# Altium schematic sheet Main MCU. Page 1.SchDoc
size 420 x 297 mm; Address1: Address1; Address2: Address2; Address3: Address3; Address4: Address4; DocumentNumber: АБВГ.123456.001 Э3; SheetNumber: 1; SheetTotal: 7; Scale: 1:1; DocumentType: Схема электрическая принципиальная; FirstReferrence: АБВГ.123456.001
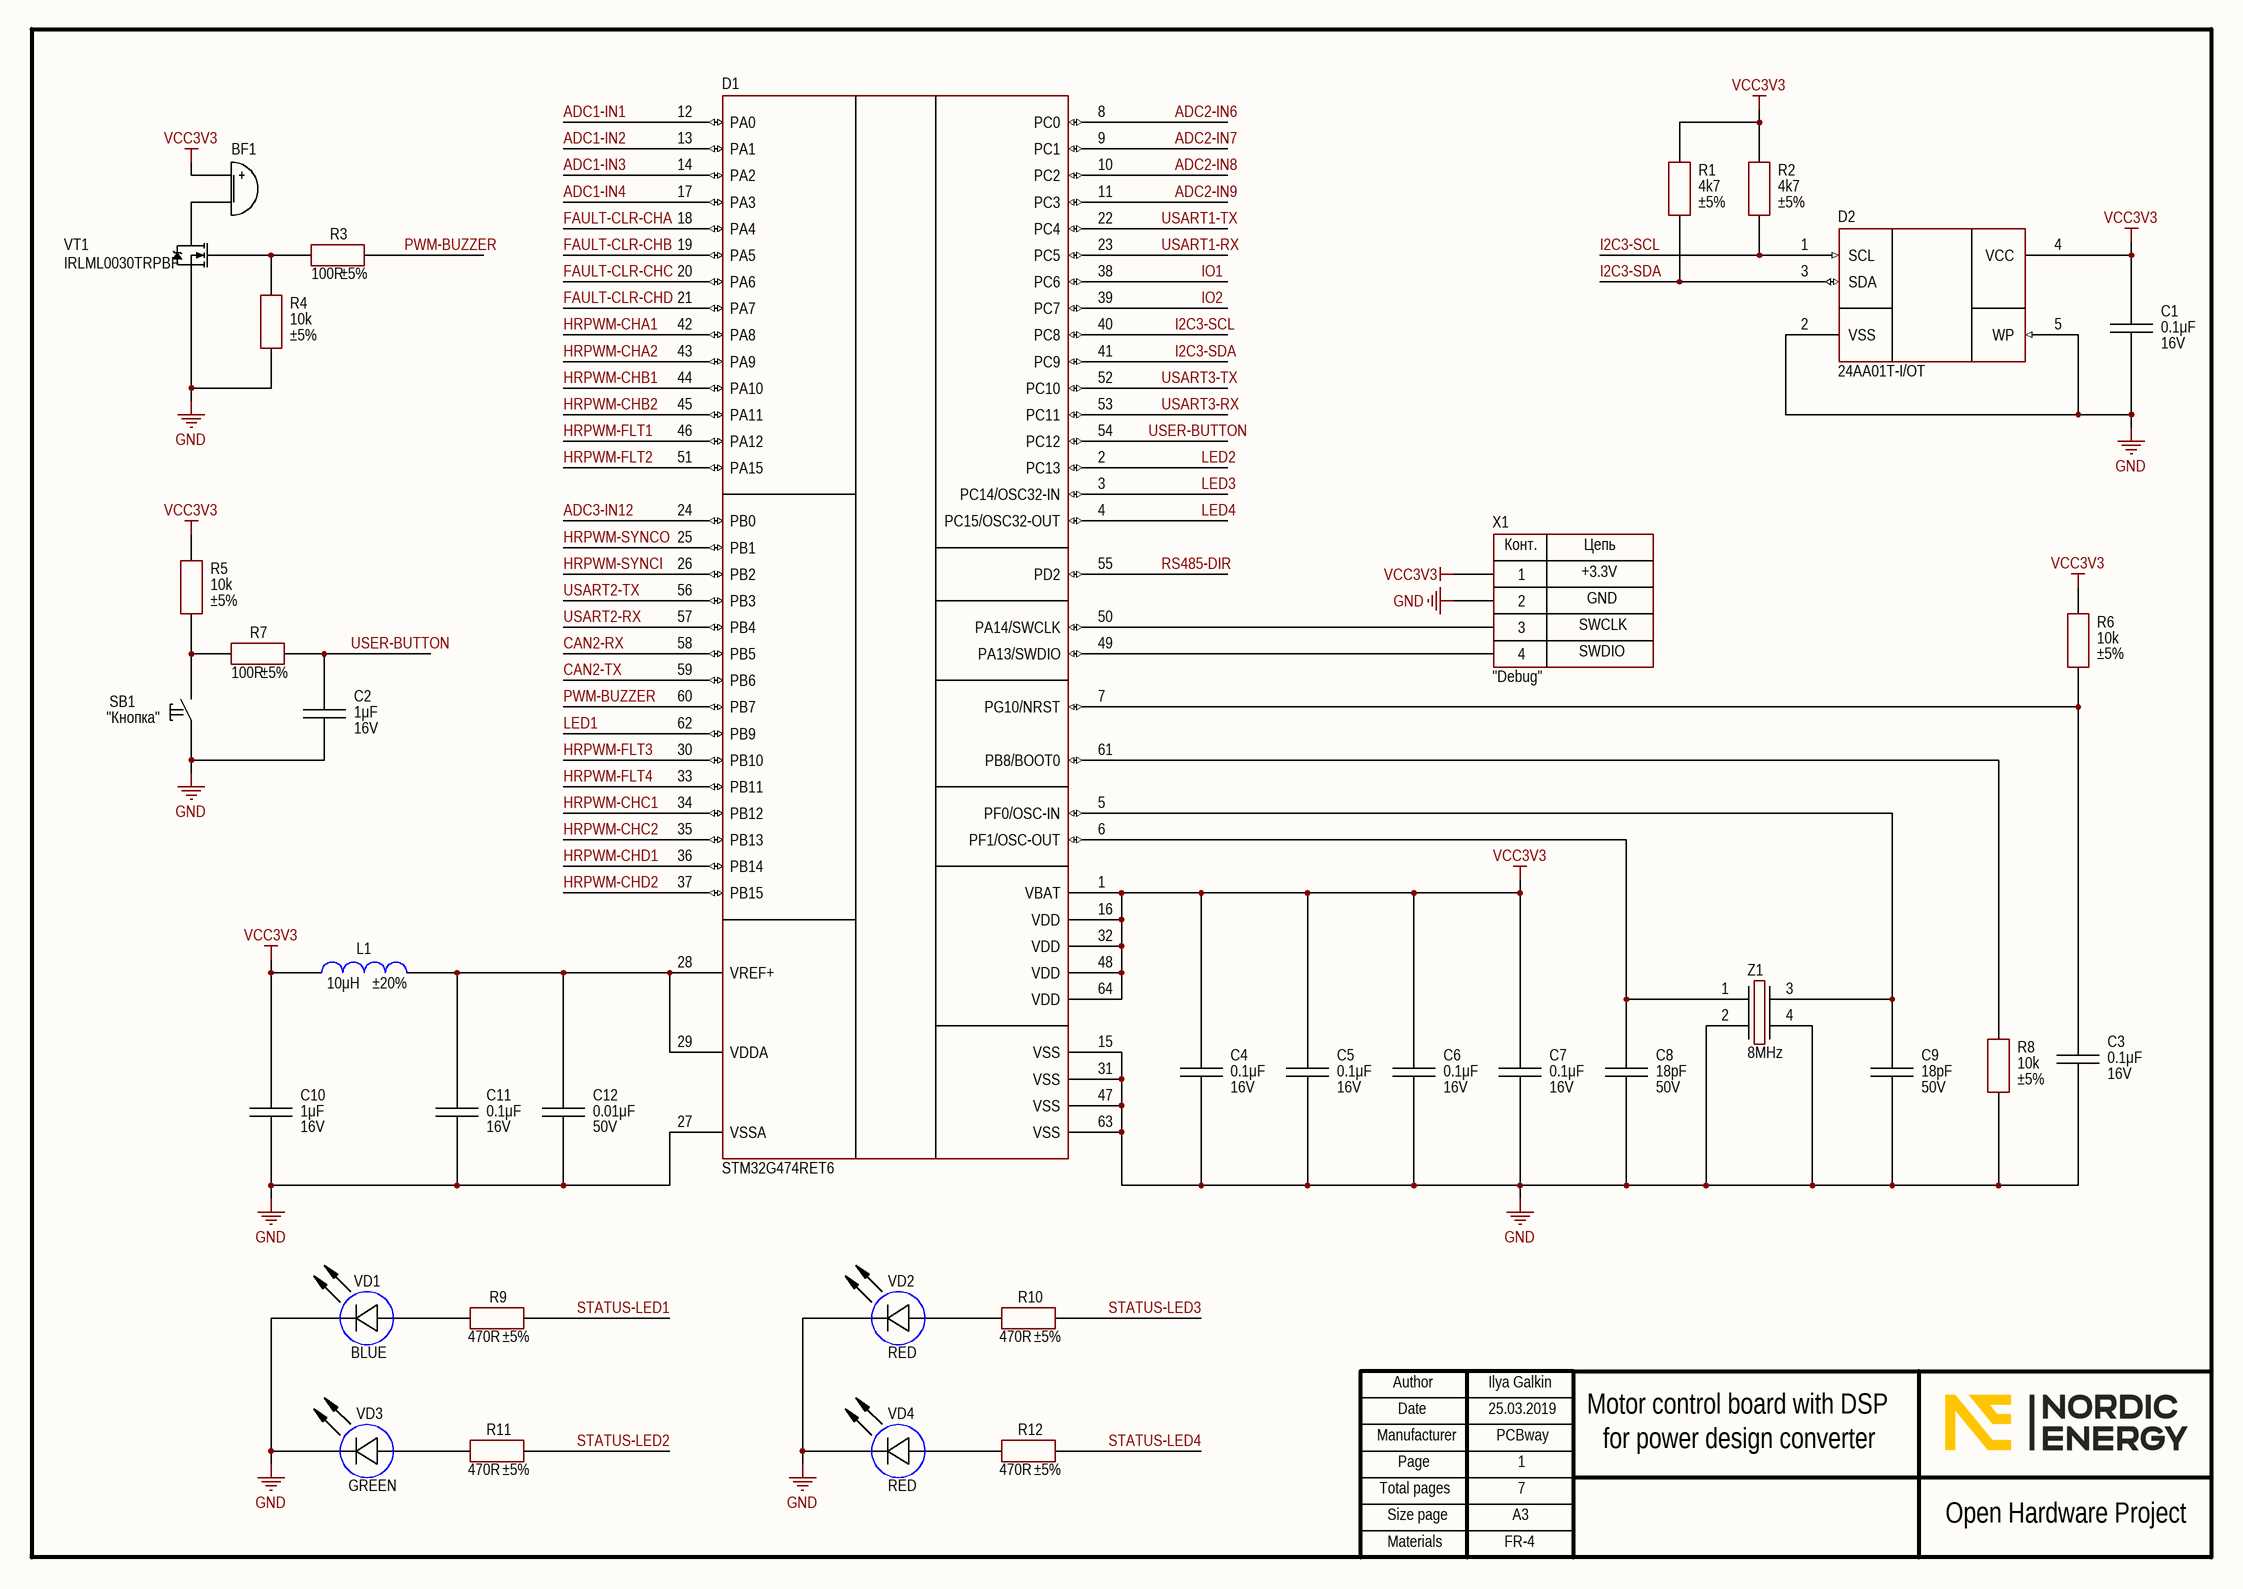
[diagram p0: Main MCU. Page 1.SchDoc]

## Parts
BF1  (no value)  [BUZ: AT-0927-TT-6-R]
C1  value 0.1μF  Voltage: 16V  [CAP: 0805]
C2  value 1μF  Voltage: 16V  [CAP: 0805]
C3  value 0.1μF  Voltage: 16V  [CAP: 0805]
C4  value 0.1μF  Voltage: 16V  [CAP: 0805]
C5  value 0.1μF  Voltage: 16V  [CAP: 0805]
C6  value 0.1μF  Voltage: 16V  [CAP: 0805]
C7  value 0.1μF  Voltage: 16V  [CAP: 0805]
C8  value 18pF  Voltage: 50V  [CAP: 0805]
C9  value 18pF  Voltage: 50V  [CAP: 0805]
C10  value 1μF  Voltage: 16V  [CAP: 0805]
C11  value 0.1μF  Voltage: 16V  [CAP: 0805]
C12  value 0.01μF  Voltage: 50V  [CAP: 0805]
D1  (no value)  [64-LQFP]
D2  PartNumber: 24AA01T-I/OT  [SOT23-5]
L1  value 10μH  Tolerance: ±20%  [IND: 0805]
R1  value 4k7  Tolerance: ±5%  [RES: 0805]
R2  value 4k7  Tolerance: ±5%  [RES: 0805]
R3  value 100R  Tolerance: ±5%  [RES: 0805]
R4  value 10k  Tolerance: ±5%  [RES: 0805]
R5  value 10k  Tolerance: ±5%  [RES: 0805]
R6  value 10k  Tolerance: ±5%  [RES: 0805]
R7  value 100R  Tolerance: ±5%  [RES: 0805]
R8  value 10k  Tolerance: ±5%  [RES: 0805]
R9  value 470R  Tolerance: ±5%  [RES: 0805]
R10  value 470R  Tolerance: ±5%  [RES: 0805]
R11  value 470R  Tolerance: ±5%  [RES: 0805]
R12  value 470R  Tolerance: ±5%  [RES: 0805]
SB1  CommentText: "Кнопка"  [BUT: 6x6 SMD]
VD1  Color: BLUE  [LED: 0805B]
VD2  Color: RED  [LED: 0805R]
VD3  Color: GREEN  [LED: 0603G]
VD4  Color: RED  [LED: 0805R]
VT1  PartNumber: IRLML0030TRPBF  [SOT23]
X1  CommentText: "Debug"  [CON: SM04B-GHS]
Z1  Frequency: 8MHz  [OSC: 5032]

## Nets
GND: C1.1 C2.1 C3.1 C4.1 C5.1 C6.1 C7.1 C8.1 C9.1 C10.1 C11.1 C12.1 D1.15(VSS) D1.27(VSSA) D1.31(VSS) D1.47(VSS) D1.63(VSS) D2.2(VSS) D2.5(WP) R4.2 R8.2 SB1.1 VD1.2(C) VD2.2(C) VD3.2(C) VD4.2(C) VT1.2(S) X1.2 Z1.2 Z1.4
VCC3V3: BF1.1(+) C1.2 C4.2 C5.2 C6.2 C7.2 C10.2 D1.1(VBAT) D1.16(VDD) D1.32(VDD) D1.48(VDD) D1.64(VDD) D2.4(VCC) L1.2 R1.1 R2.1 R5.1 R6.1 X1.1
ADC1-IN1: D1.12(PA0)
ADC1-IN2: D1.13(PA1)
ADC1-IN3: D1.14(PA2)
ADC1-IN4: D1.17(PA3)
ADC2-IN6: D1.8(PC0)
ADC2-IN7: D1.9(PC1)
ADC2-IN8: D1.10(PC2)
ADC2-IN9: D1.11(PC3)
ADC3-IN12: D1.24(PB0)
CAN2-RX: D1.58(PB5)
CAN2-TX: D1.59(PB6)
FAULT-CLR-CHA: D1.18(PA4)
FAULT-CLR-CHB: D1.19(PA5)
FAULT-CLR-CHC: D1.20(PA6)
FAULT-CLR-CHD: D1.21(PA7)
HRPWM-CHA1: D1.42(PA8)
HRPWM-CHA2: D1.43(PA9)
HRPWM-CHB1: D1.44(PA10)
HRPWM-CHB2: D1.45(PA11)
HRPWM-CHC1: D1.34(PB12)
HRPWM-CHC2: D1.35(PB13)
HRPWM-CHD1: D1.36(PB14)
HRPWM-CHD2: D1.37(PB15)
HRPWM-FLT1: D1.46(PA12)
HRPWM-FLT2: D1.51(PA15)
HRPWM-FLT3: D1.30(PB10)
HRPWM-FLT4: D1.33(PB11)
HRPWM-SYNCI: D1.26(PB2)
HRPWM-SYNCO: D1.25(PB1)
I2C3-SCL: D1.40(PC8) D2.1(SCL) R2.2
I2C3-SDA: D1.41(PC9) D2.3(SDA) R1.2
IO1: D1.38(PC6)
IO2: D1.39(PC7)
LED1: D1.62(PB9)
LED2: D1.2(PC13)
LED3: D1.3(PC14/OSC32-IN)
LED4: D1.4(PC15/OSC32-OUT)
PWM-BUZZER: D1.60(PB7) R3.2
RS485-DIR: D1.55(PD2)
STATUS-LED1: R9.2
STATUS-LED2: R11.2
STATUS-LED3: R10.2
STATUS-LED4: R12.2
USART1-RX: D1.23(PC5)
USART1-TX: D1.22(PC4)
USART2-RX: D1.57(PB4)
USART2-TX: D1.56(PB3)
USART3-RX: D1.53(PC11)
USART3-TX: D1.52(PC10)
USER-BUTTON: C2.2 D1.54(PC12) R7.2
NetBF1_2: BF1.2(-) VT1.3(D)
NetC3_2: C3.2 D1.7(PG10/NRST) R6.2
NetC8_2: C8.2 D1.6(PF1/OSC-OUT) Z1.1
NetC9_2: C9.2 D1.5(PF0/OSC-IN) Z1.3
NetC11_2: C11.2 C12.2 D1.28(VREF+) D1.29(VDDA) L1.1
NetD1_49: D1.49(PA13/SWDIO) X1.4
NetD1_50: D1.50(PA14/SWCLK) X1.3
NetD1_61: D1.61(PB8/BOOT0) R8.1
NetR3_1: R3.1 R4.1 VT1.1(G)
NetR5_2: R5.2 R7.1 SB1.2
NetR9_1: R9.1 VD1.1(A)
NetR10_1: R10.1 VD2.1(A)
NetR11_1: R11.1 VD3.1(A)
NetR12_1: R12.1 VD4.1(A)

## Notes on the sheet
- +3.3V
- SWDIO
- SWCLK
- GND
- Ilya Galkin
- 25.03.2019
- PCBway
- 1
- Motor control board with DSP
- for power design converter
- 7
- FR-4
- Author
- Manufacturer
- Date
- Page
- Total pages
- Size page
- A3
- Open Hardware Project
- Materials
- (in symbol Connector_SM04B) Конт.; Цепь

## Library data of the parts
BF1 = Buzzer: Manufacturer: PUI Audio; ValueManufacturerPartNumber: DIP switch, 2.73 kHz, 3VDC, 80mA, -20...+70°C; PartNumber: AT-0927-TT-6-R; TypeBuzzer: DIP switch; VoltageMax: 3VDC; Frequency: 2.73 kHz; CurrentMax: 80mA; HelpURL: https://www.digikey.com/products/en?keywords=AT-0927-TT-6-R; Temperature: -20...+70°C
C1 C3-C7 C11 = Ceramic_0805: Manufacturer: Yageo; PartNumber: CC0805KRX7R7BB104; ValueManufacturerPartNumber: Ceramic capacitor, 0.1μF, X7R, ±10%, 16V, 0805, -55...+125°C; TypeCapacitor: Ceramic capacitor; Tolerance: ±10%; TypeDielectric: X7R; Package: 0805; HelpURL: https://www.digikey.com/product-detail/en/yageo/CC0805KRX7R7BB104/311-1142-1-ND/303052; Temperature: -55...+125°C
C2 C10 = Ceramic_0805: Manufacturer: Yageo; PartNumber: CC0805KKX7R7BB105; ValueManufacturerPartNumber: Ceramic capacitor, 1μF, X7R, ±10%, 16V, 0805, -55...+125°C; TypeCapacitor: Ceramic capacitor; Tolerance: ±10%; TypeDielectric: X7R; Package: 0805; HelpURL: https://www.digikey.com/product-detail/en/yageo/CC0805KKX7R7BB105/311-1365-1-ND/2103149; Temperature: -55...+125°C
C8 C9 = Ceramic_0805: Manufacturer: Yageo; PartNumber: CC0805JRNPO9BN180; ValueManufacturerPartNumber: Ceramic capacitor, 18pF, NPO, ±10%, 50V, 0805, -55...+125°C; TypeCapacitor: Ceramic capacitor; Tolerance: ±10%; TypeDielectric: NPO; Package: 0805; HelpURL: https://www.digikey.com/product-detail/en/yageo/CC0805JRNPO9BN180/311-1102-1-ND/303012; Temperature: -55...+125°C
C12 = Ceramic_0805: Manufacturer: Yageo; PartNumber: CC0805KRX7R9BB103; ValueManufacturerPartNumber: Ceramic capacitor, 0.01μF, X7R, ±10%, 50V, 0805, -55...+125°C; TypeCapacitor: Ceramic capacitor; Tolerance: ±10%; TypeDielectric: X7R; Package: 0805; HelpURL: https://www.digikey.com/product-detail/en/yageo/CC0805KRX7R9BB103/311-1136-1-ND/303046; Temperature: -55...+125°C
D1 = STM32G474RET6: Cortex-M4; Manufacturer: STMicroelectronics; ValueManufacturerPartNumber: IC microcontroller, 32-Bit, Cortex-M4, 170MHz, 512KB, 128KB, 1.71...3.6V, -40...+85°C, 64-LQFP; Supply: 1.71...3.6V; Speed: 170MHz; CoreSize: 32-Bit; MemoryROM: 512KB; MemoryRAM: 128KB; HelpURL: https://ru.mouser.com/ProductDetail/STMicroelectronics/STM32G474RET6?qs=sGAEpiMZZMuoKKEcg8mMKJ29ob8kKavQ9P%2FqSgFiHIM%252Bu3HfOPgZJg%3D%3D; Package: 64-LQFP; ComponentType: IC microcontroller; Temperature: -40...+85°C; CoreProcessor: Cortex-M4; PartNumber: STM32G474RET6
D2 = 24AA01T: EEPROM; Manufacturer: Microchip Technology; ValueManufacturerPartNumber: IC memory, EEPROM, 1KB (128x8), 400 kHz, I2C, 1.7...5.5V, -40...+85°C, SOT-23-5; Supply: 1.7...5.5V; Speed: 400 kHz; InterfaceData: I2C; MemorySize: 1KB (128x8); HelpURL: https://www.digikey.com/product-detail/en/microchip-technology/24AA01T-I-OT/24AA01T-I-OTCT-ND/857670; Package: SOT-23-5; ComponentType: IC memory; Temperature: -40...+85°C; MemoryType: EEPROM
L1 = Inductor_0805: Manufacturer: Murata Electronics; PartNumber: LQM21FN100M70L; ValueManufacturerPartNumber: Fixed inductor, 10μH, ±20%, 0805, 100mA, -55...+125°C; TypeInductor: Fixed inductor; MaxCurrent: 100mA; Package: 0805; HelpURL: https://www.digikey.com/product-detail/en/murata-electronics-north-america/LQM21FN100M70L/490-4029-1-ND/1016289; Temperature: -55...+125°C
R1 R2 = Resistor_0805: Manufacturer: Yageo; PartNumber: RC0805JR-074K7L; ValueManufacturerPartNumber: Resistor film, 4k7, ±5%, 0805, 0.125W, -55...+125°C; TypeResistor: Resistor film; Power: 0.125W; Package: 0805; HelpURL: https://www.digikey.com/product-detail/en/yageo/RC0805JR-074K7L/311-4.7KARCT-ND/731274; Temperature: -55...+125°C
R3 R7 = Resistor_0805: Manufacturer: Yageo; PartNumber: RC0805JR-07100RL; ValueManufacturerPartNumber: Resistor film, 100R, ±5%, 0805, 0.125W, -55...+125°C; TypeResistor: Resistor film; Power: 0.125W; Package: 0805; HelpURL: https://www.digikey.com/product-detail/en/yageo/RC0805JR-07100RL/311-100ARCT-ND/731185; Temperature: -55...+125°C
R4-R6 R8 = Resistor_0805: Manufacturer: Yageo; PartNumber: RC0805JR-0710KL; ValueManufacturerPartNumber: Resistor film, 10k, ±5%, 0805, 0.125W, -55...+125°C; TypeResistor: Resistor film; Power: 0.125W; Package: 0805; HelpURL: https://www.digikey.com/product-detail/en/yageo/RC0805JR-0710KL/311-10KARCT-ND/731188; Temperature: -55...+125°C
R9-R12 = Resistor_0805: Manufacturer: Yageo; PartNumber: RC0805JR-07470RL; ValueManufacturerPartNumber: Resistor film, 470R, ±5%, 0805, 0.125W, -55...+125°C; TypeResistor: Resistor film; Power: 0.125W; Package: 0805; HelpURL: https://www.digikey.com/product-detail/en/yageo/RC0805JR-07470RL/311-470ARCT-ND/731280; Temperature: -55...+125°C
SB1 = Button_tactile: Manufacturer: TE Connectivity; ValueManufacturerPartNumber: Tactile button, 6x6mm; PartNumber: FSM2JSMAATR; TypeButton: Tactile button; HelpURL: https://www.digikey.com/product-detail/en/te-connectivity-alcoswitch-switches/FSM2JSMAATR/450-1792-1-ND/3503931; Package: 6x6mm
VD1 = LED_single: Manufacturer: Wurth; ValueManufacturerPartNumber: LED, 20mA, 3.2V, 0805, -55...+150°C; PartNumber: 150080BS75000; TypeDiode: LED; Current: 20mA; VoltageDrop: 3.2V; Package: 0805; HelpURL: https://www.digikey.com/product-detail/en/wurth-electronics-inc/150080BS75000/732-4982-1-ND/4489910; Temperature: -55...+150°C
VD2 VD4 = LED_single: Manufacturer: Wurth; ValueManufacturerPartNumber: LED, 20mA, 2V, 0805, -55...+150°C; PartNumber: 150080RS75000; TypeDiode: LED; Current: 20mA; VoltageDrop: 2V; Package: 0805; HelpURL: https://www.digikey.com/product-detail/en/wurth-electronics-inc/150080RS75000/732-4984-1-ND/4489916; Temperature: -55...+150°C
VD3 = LED_single: Manufacturer: Wurth; ValueManufacturerPartNumber: LED, 20mA, 2V, 0805, -55...+150°C; PartNumber: 150080VS75000; TypeDiode: LED; Current: 20mA; VoltageDrop: 2V; Package: 0805; HelpURL: https://www.digikey.com/product-detail/en/wurth-electronics-inc/150080VS75000/732-4986-1-ND/4489922; Temperature: -55...+150°C
VT1 = MOSFET_N_132: Manufacturer: Infineon Technologies; ValueManufacturerPartNumber: MOSFET N-channel transistor, 30V, 5.3A, 2.6nC, 2.5W, 27mOhm, 382pF, SOT-23, -55...+150°C; TypeTransistor: MOSFET N-channel transistor; VoltageDS: 30V; CurrentDS: 5.3A; RDS: 27mOhm; GateCharge: 2.6nC; InputCapacitor: 382pF; MaxPower: 2.5W; Package: SOT-23; HelpURL: https://www.digikey.com/product-detail/en/infineon-technologies/IRLML0030TRPBF/IRLML0030TRPBFCT-ND/2202231; Temperature: -55...+150°C
X1 = Connector_SM04B: Manufacturer: JST; ValueManufacturerPartNumber: Connector, 4pin, 1.25mm, 50VDC, 1A; PartNumber: SM04B-GHS; VoltageMax: 50VDC; Pitch: 1.25mm; CurrentMax: 1A; Multichannel: 4pin; HelpURL: https://www.digikey.com/product-detail/en/jst-sales-america-inc/SM04B-GHS-TB-LF-SN/455-1566-1-ND/807834; TypeConnector: Connector
Z1 = Crystal_5032: Manufacturer: Diodes Incorporated; PartNumber: ABM3B-8.000MHZ-B2-T; ValueManufacturerPartNumber: Crystal, 8MHz, 18pF, ±30ppm, case 5032, -20...+70°C; LoadCapacitance: 18pF; Tolerance: ±30ppm; Package: case 5032; HelpURL: https://www.digikey.com/product-detail/en/abracon-llc/ABM3B-8.000MHZ-B2-T/535-9720-1-ND/1873254; Temperature: -20...+70°C; TypeOscilator: Crystal